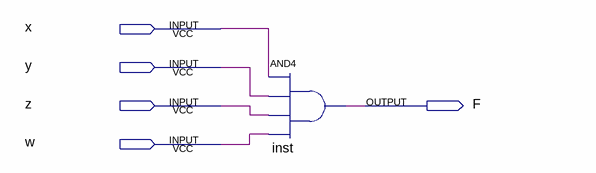
[diagram p0: schematic sheet]
// Quartus schematic Lab_1_Lytvyn.bdf as structural Verilog: 1 symbols, 5 pins
module Lab_1_Lytvyn (
  input  x,
  input  y,
  input  z,
  input  w,
  output F
);

  and inst (F, x, y, z, w);
endmodule
